# EAGLE design wts_transmitter (EAGLE 7.2.0)
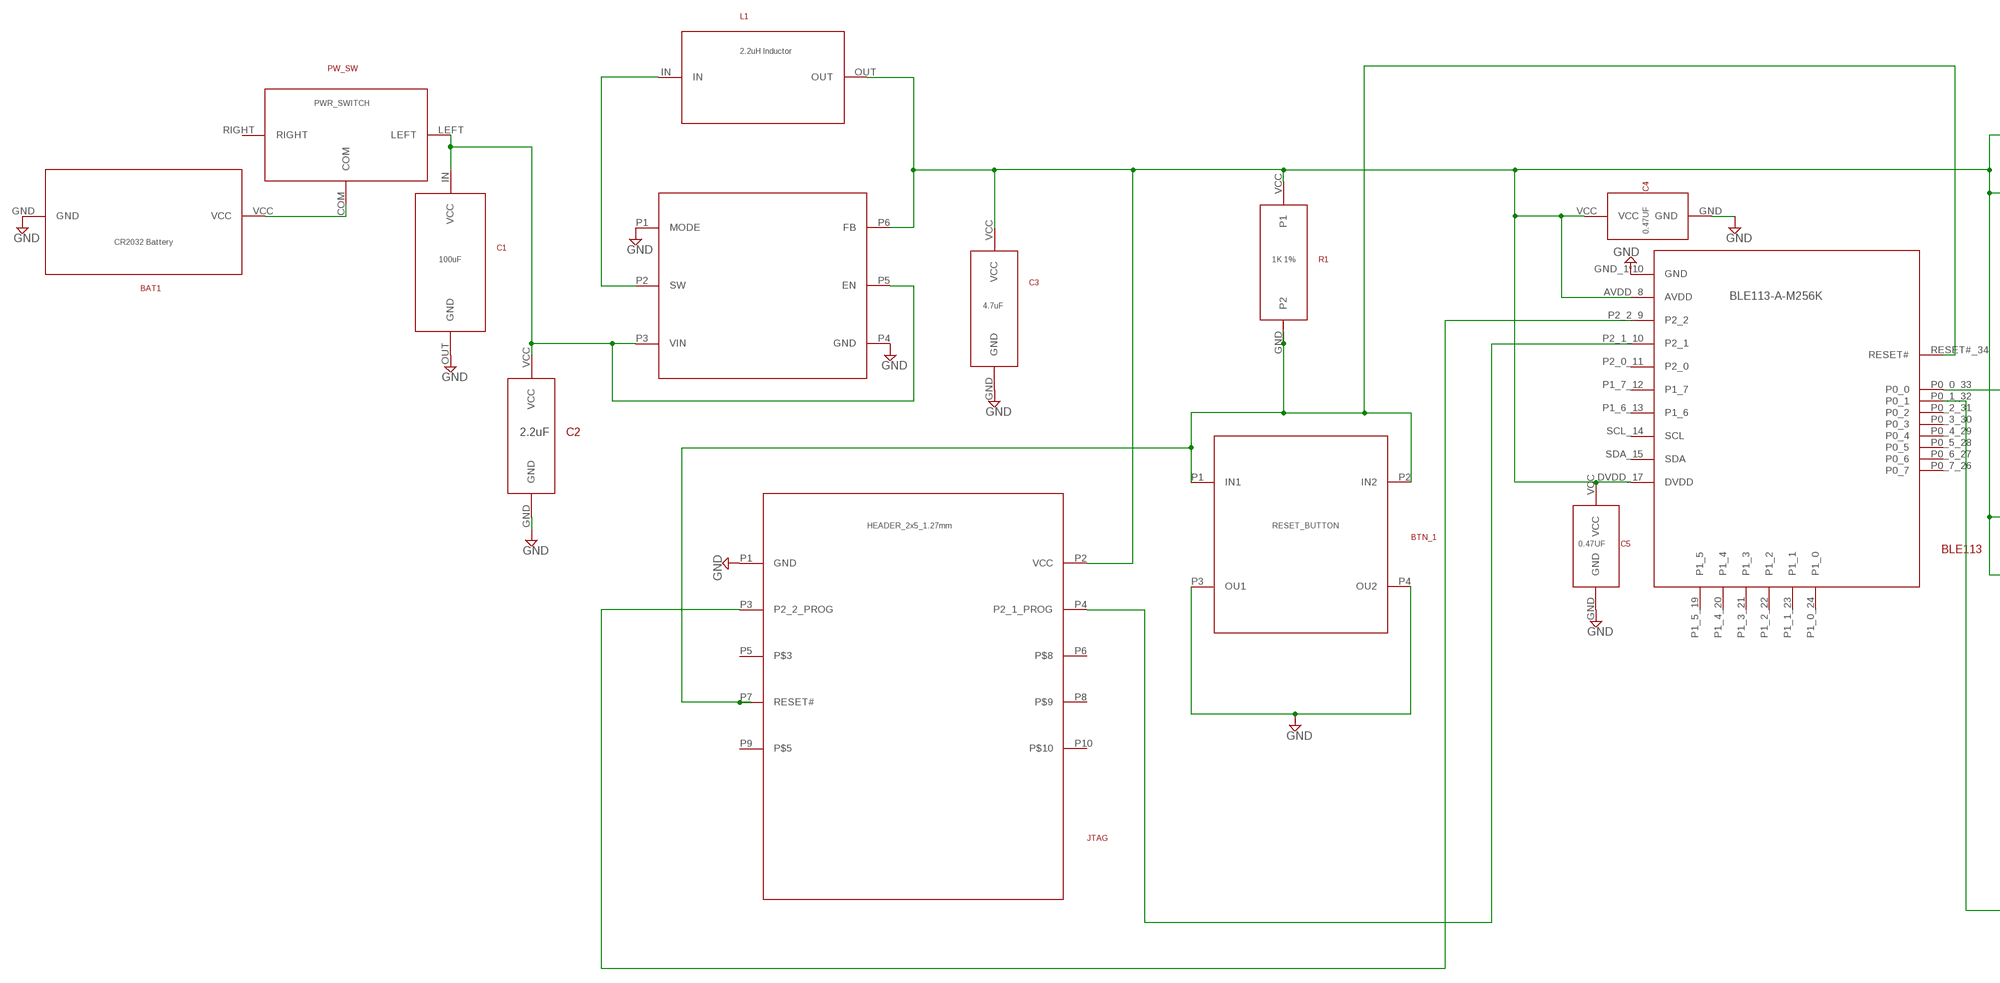
[diagram p0: schematic, sheet 1, part 1 of 2]
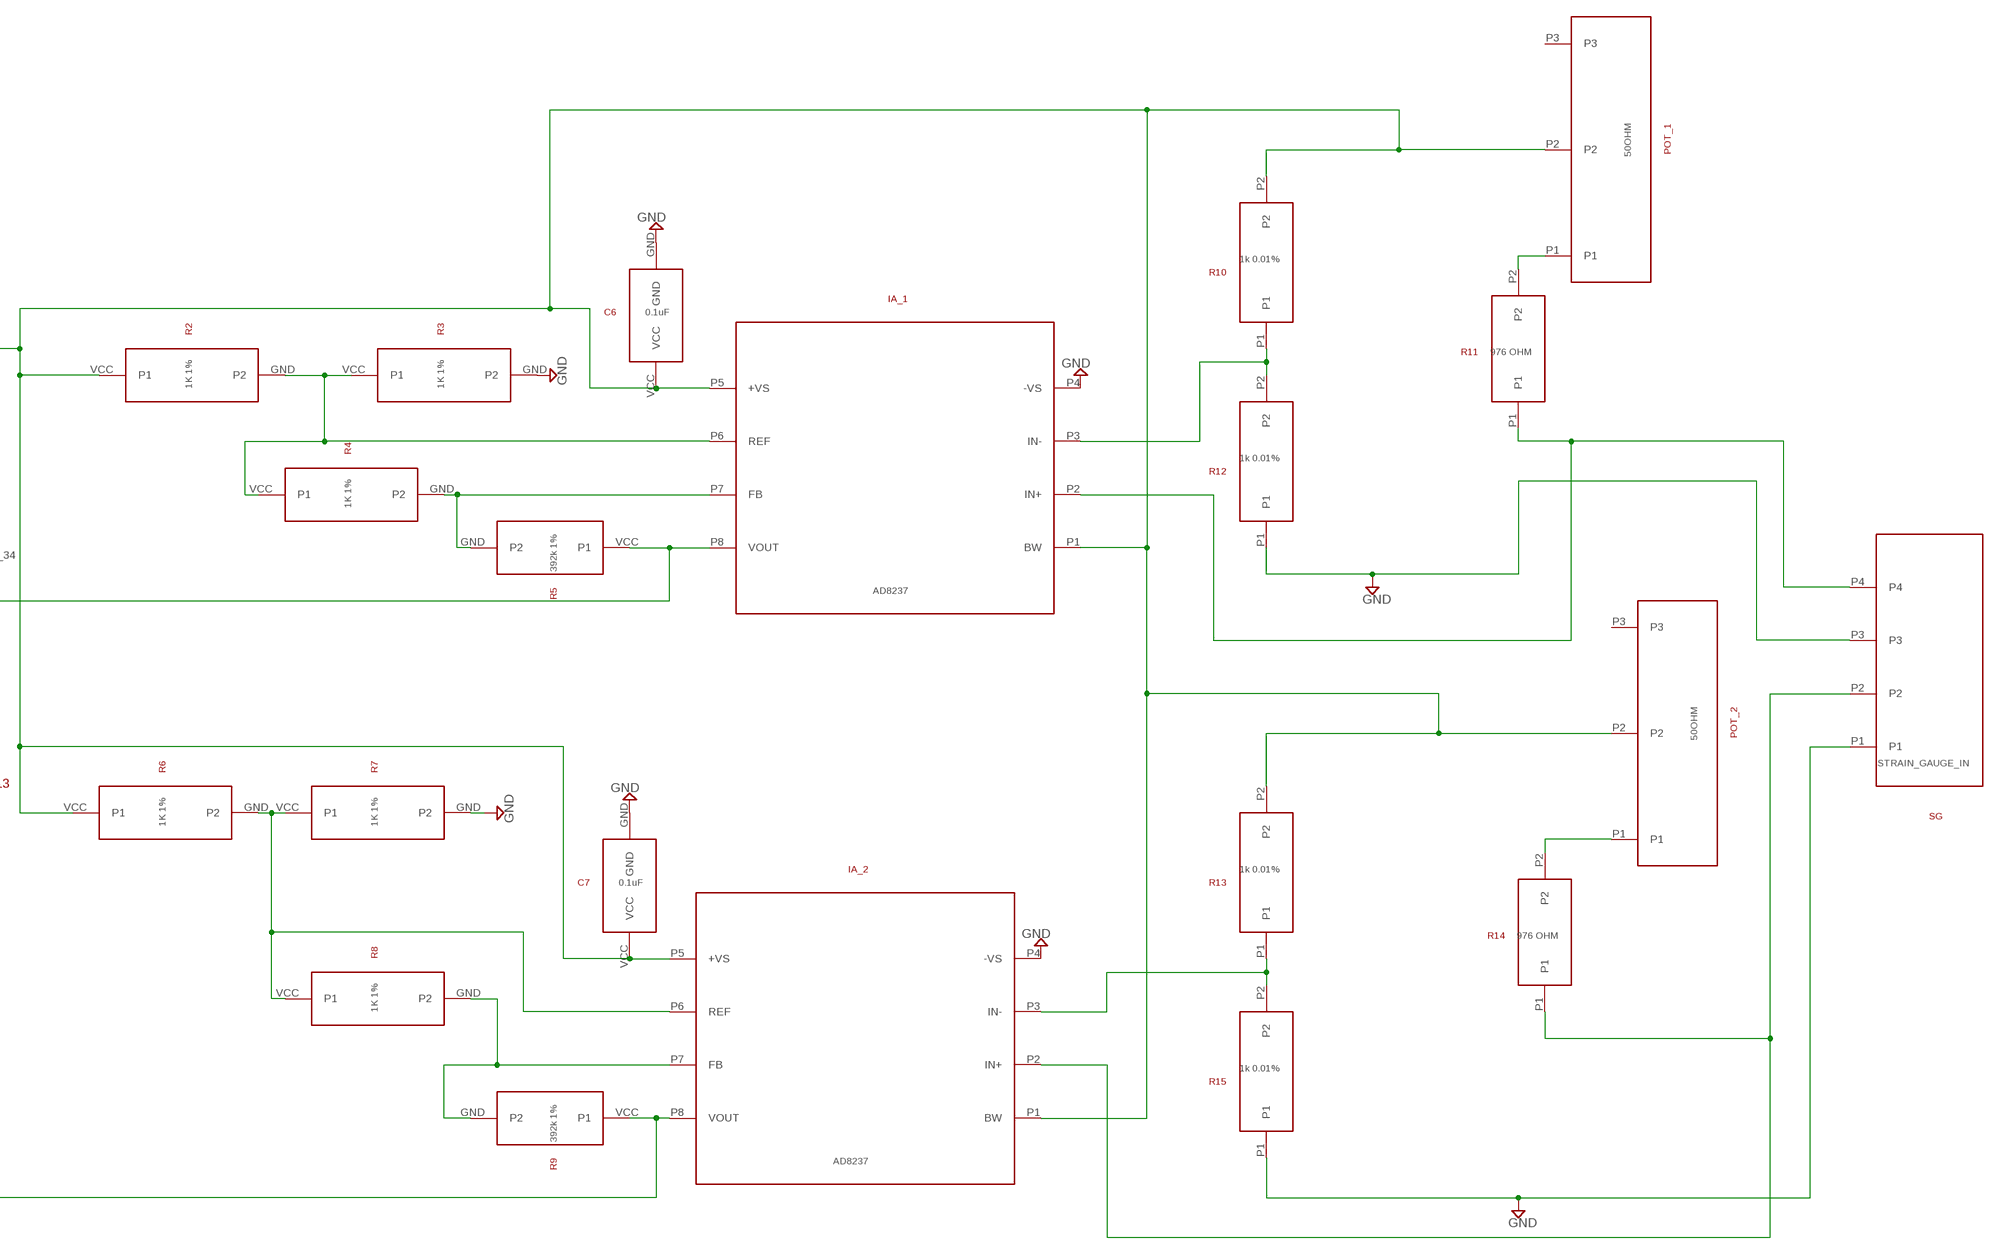
[diagram p1: schematic, sheet 1, part 2 of 2]

## Parts
BAT1  CR2032  [CR2032]
BLE113  BLE113-A-M256K  [BLE113]
BTN_1  RESET_BUTTON  [RESET_SMT]
C1  100UF_CAP  [1206]
C2  2.2UF_CAP  [0603]
C3  4.7UF_CAP  [0603]
C4  0.47UF_CAP  [0402]
C5  0.47UF_CAP  [0402]
C6  0.1UF_CAP  [0402]
C7  0.1UF_CAP  [0402]
DC_DC  TPS62234  [DRY6]
IA_1  AD8237  [MSOP8]
IA_2  AD8237  [MSOP8]
JTAG  JTAG_HEADER  [1.27MM_2X5_HEADER]
L1  2.2UH_INDUCTOR  [1206]
POT_1  50OHM_TRIMPOT  [PV36W_TRIMPOT]
POT_2  50OHM_TRIMPOT  [PV36W_TRIMPOT]
PW_SW  PWR_SWITCH  [PWR_SWITCH]
R1  1KOHM_RESISTOR_1%  [0603]
R2  1KOHM_RESISTOR_1%  [0603]
R3  1KOHM_RESISTOR_1%  [0603]
R4  1KOHM_RESISTOR_1%  [0603]
R5  392KOHM_RESISTOR_1%  [0603]
R6  1KOHM_RESISTOR_1%  [0603]
R7  1KOHM_RESISTOR_1%  [0603]
R8  1KOHM_RESISTOR_1%  [0603]
R9  392KOHM_RESISTOR_1%  [0603]
R10  1KOHM_RESISTOR_0.01%  [0805]
R11  976OHM_RESISTOR  [0805]
R12  1KOHM_RESISTOR_0.01%  [0805]
R13  1KOHM_RESISTOR_0.01%  [0805]
R14  976OHM_RESISTOR  [0805]
R15  1KOHM_RESISTOR_0.01%  [0805]
SG  4_PIN_5.08MM_TERMINAL  [5.08MM_4PIN_HEADER]

## Nets
3V: C1.IN(VCC) C2.VCC DC_DC.P3(VIN) DC_DC.P5(EN) PW_SW.LEFT
3V_BAT: BAT1.VCC PW_SW.COM
GND: BAT1.GND BLE113.GND_1(GND) BLE113.GND_2(GND) BLE113.GND_3(GND) BLE113.GND_4(GND) BLE113.GND_5(GND) BLE113.GND_6(GND) BLE113.GND_7(GND) BLE113.GND_18(GND) BLE113.GND_25(GND) BLE113.GND_36(GND) BTN_1.P3(OU1) BTN_1.P4(OU2) C1.OUT(GND) C2.GND C3.GND C4.GND C5.GND C6.GND C7.GND DC_DC.P1(MODE) DC_DC.P4(GND) IA_1.P4(-VS) IA_2.P4(-VS) JTAG.P1(GND) R3.GND(P2) R7.GND(P2) R12.P1 R15.P1 SG.P1 SG.P3
N$3: DC_DC.P2(SW) L1.IN
N$5: BLE113.P0_0_33(P0_0) IA_1.P8(VOUT) R5.VCC(P1)
N$6: BLE113.P0_1_32(P0_1) IA_2.P8(VOUT) R9.VCC(P1)
N$7: BLE113.P2_2_9(P2_2) JTAG.P3(P2_2_PROG)
N$8: IA_2.P3(IN-) R13.P1 R15.P2
N$9: IA_2.P6(REF) R6.GND(P2) R7.VCC(P1) R8.VCC(P1)
N$10: IA_2.P7(FB) R8.GND(P2) R9.GND(P2)
N$11: BLE113.P2_1_10(P2_1) JTAG.P4(P2_1_PROG)
N$12: BLE113.RESET#_34(RESET#) BTN_1.P1(IN1) BTN_1.P2(IN2) JTAG.P7(RESET#) R1.GND(P2)
N$13: IA_1.P6(REF) R2.GND(P2) R3.VCC(P1) R4.VCC(P1)
N$14: IA_1.P7(FB) R4.GND(P2) R5.GND(P2)
N$15: POT_1.P1 R11.P2
N$16: IA_1.P3(IN-) R10.P1 R12.P2
N$17: IA_1.P2(IN+) R11.P1 SG.P4
N$20: POT_2.P1 R14.P2
N$21: IA_2.P2(IN+) R14.P1 SG.P2
PWR: BLE113.AVDD_8(AVDD) BLE113.DVDD_17(DVDD) C3.VCC C4.VCC C5.VCC C6.VCC C7.VCC DC_DC.P6(FB) IA_1.P1(BW) IA_1.P5(+VS) IA_2.P1(BW) IA_2.P5(+VS) JTAG.P2(VCC) L1.OUT POT_1.P2 POT_2.P2 R1.VCC(P1) R2.VCC(P1) R6.VCC(P1) R10.P2 R13.P2
Unconnected: BLE113.P0_2_31(P0_2) BLE113.P0_3_30(P0_3) BLE113.P0_4_29(P0_4) BLE113.P0_5_28(P0_5) BLE113.P0_6_27(P0_6) BLE113.P0_7_26(P0_7) BLE113.P1_0_24(P1_0) BLE113.P1_1_23(P1_1) BLE113.P1_2_22(P1_2) BLE113.P1_3_21(P1_3) BLE113.P1_4_20(P1_4) BLE113.P1_5_19(P1_5) BLE113.P1_6_13(P1_6) BLE113.P1_7_12(P1_7) BLE113.P2_0_11(P2_0) BLE113.SCL_14(SCL) BLE113.SDA_15(SDA) JTAG.P5 JTAG.P6 JTAG.P8 JTAG.P9 JTAG.P10 POT_1.P3 POT_2.P3 PW_SW.RIGHT

## Library data of the parts
BAT1 = wts_transmitter:CR2032
BLE113 = wts_transmitter:BLE113-A-M256K
BTN_1 = wts_transmitter:RESET_BUTTON
C1 = wts_transmitter:100UF_CAP
C2 = wts_transmitter:2.2UF_CAP
C3 = wts_transmitter:4.7UF_CAP
C4 C5 = wts_transmitter:0.47UF_CAP
C6 C7 = wts_transmitter:0.1UF_CAP
DC_DC = wts_transmitter:TPS62234
IA_1 IA_2 = wts_transmitter:AD8237
JTAG = wts_transmitter:JTAG_HEADER
L1 = wts_transmitter:2.2UH_INDUCTOR
POT_1 POT_2 = wts_transmitter:50OHM_TRIMPOT
PW_SW = wts_transmitter:PWR_SWITCH
R1-R4 R6-R8 = wts_transmitter:1KOHM_RESISTOR_1%
R5 R9 = wts_transmitter:392KOHM_RESISTOR_1%
R10 R12 R13 R15 = wts_transmitter:1KOHM_RESISTOR_0.01%
R11 R14 = wts_transmitter:976OHM_RESISTOR
SG = wts_transmitter:4_PIN_5.08MM_TERMINAL

## Net classes
0 default: clearance 0.205 mm

## Board
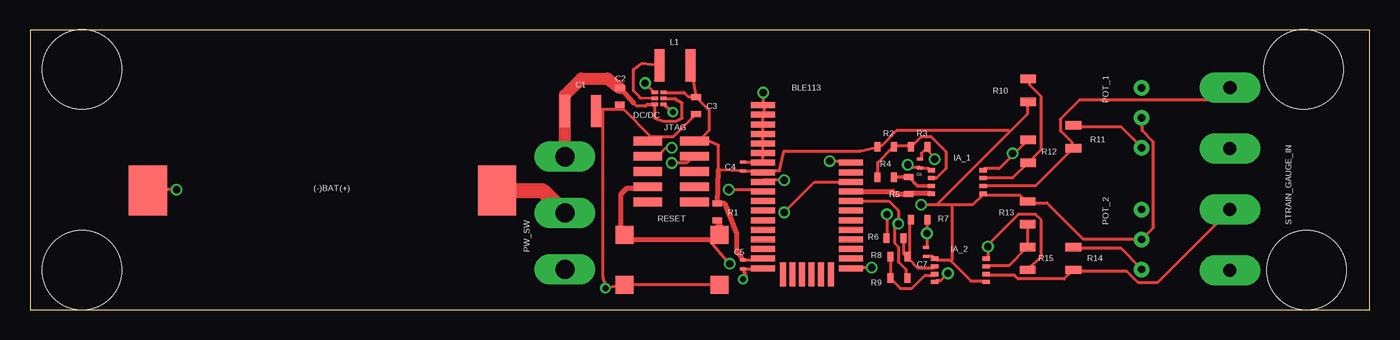
[diagram p2: board, top side]
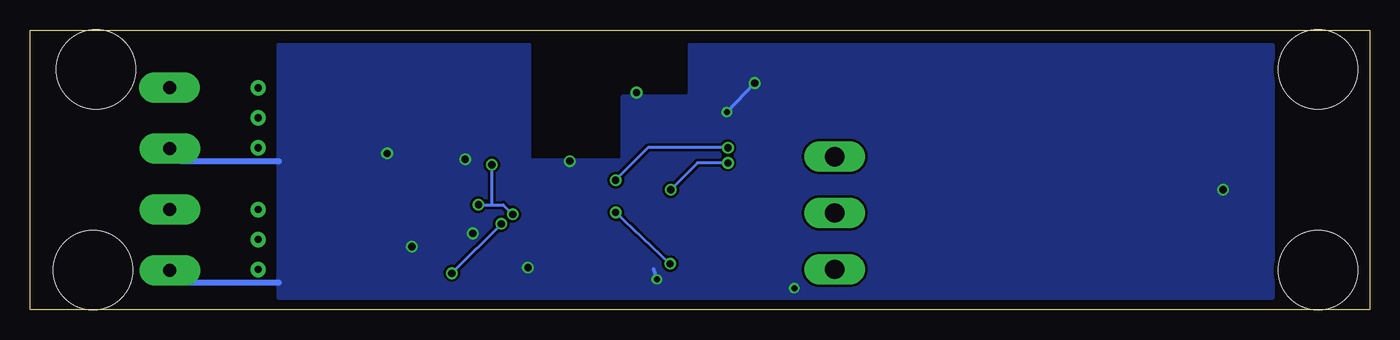
[diagram p3: board, bottom side, seen from below]

Size 111.68 x 23.36 mm. Coordinates in mm from the lower left corner, seen from the top.
Outline: 0,0 111.68,0 111.68,23.36 0,23.36 0,0
Copper layers (1*16): Top 0.0356mm / dielectric 1.5011mm / Bottom 0.0356mm
Design rules "LaenPCBOrder": minimum track width 6mil, minimum drill 13mil, track to track 6mil, track to pad 6mil, pad to pad 6mil, via to via 6mil, smd to smd 6mil, copper to edge 15mil, drill to drill 6mil, minimum pad ring 7mil, minimum via ring 7mil, stop-mask expansion 3mil, vias tented up to drill 0mil, thermal gap 10mil
Holes 6.6 mm at 4.32,20.07 4.32,3.3 106.17,20.07 106.43,3.3

### Footprints (pad centres in the part's own frame; a part is rotated, then mirrored left to right if it is on the bottom)
CR2032 = smd 3.2 x 4.2: GND 30.8,3.5; VCC 1.7,3.5
BLE113 = smd 2 x 0.5: AVDD_8 0.9,9.45; DVDD_17 0.9,2.25; GND_1 0.9,15.05; GND_2 0.9,14.25; GND_3 0.9,13.45; GND_4 0.9,12.65; GND_5 0.9,11.85; GND_6 0.9,11.05; GND_7 0.9,10.25; GND_18 0.9,1.45; GND_25 8.22,1.45; GND_36 8.22,10.25; NC_16 0.9,3.05; NC_35 8.22,9.45; P0_0_33 8.22,7.85; P0_1_32 8.22,7.05; P0_2_31 8.22,6.25; P0_3_30 8.22,5.45; P0_4_29 8.22,4.65; P0_5_28 8.22,3.85; P0_6_27 8.22,3.05; P0_7_26 8.22,2.25; P1_6_13 0.9,5.45; P1_7_12 0.9,6.25; P2_0_11 0.9,7.05; P2_1_10 0.9,7.85; P2_2_9 0.9,8.65; RESET#_34 8.22,8.65; SCL_14 0.9,4.65; SDA_15 0.9,3.85 | smd 0.5 x 2: P1_0_24 6.56,0.95; P1_1_23 5.76,0.95; P1_2_22 4.96,0.95; P1_3_21 4.16,0.95; P1_4_20 3.36,0.95; P1_5_19 2.56,0.95
RESET_SMT = smd 1.5 x 1.5: P1 0.8,5; P2 8.7,5; P3 0.8,0.8; P4 8.7,0.8
1206 = smd 0.85 x 2.7: IN 0.4,1.35; OUT 3,1.35
0603 = smd 0.8 x 0.5: GND 0.4,0.1; VCC 0.4,1.5
0402 = smd 0.5 x 0.25: GND 0.25,0.12; VCC 0.25,0.87
DRY6 = smd 0.279 x 0.52: P1 0.15,0.26; P2 0.65,0.26; P3 1.15,0.26; P4 1.15,1; P5 0.65,1; P6 0.15,1
MSOP8 = smd 0.35 x 0.6: P1 0.55,0.3; P2 1.2,0.3; P3 1.85,0.3; P4 2.5,0.3; P5 2.5,4.6; P6 1.85,4.6; P7 1.2,4.6; P8 0.55,4.6
1.27MM_2X5_HEADER = smd 2.4 x 0.74: P1 1.2,5.45; P2 5.1,5.45; P3 1.2,4.18; P4 5.1,4.18; P5 1.2,2.91; P6 5.1,2.91; P7 1.2,1.64; P8 5.1,1.64; P9 1.2,0.37; P10 5.1,0.37
PV36W_TRIMPOT = drill 0.6 pad 1.27: P1 7.3,2.5; P2 4.8,2.5; P3 2.3,2.5
PWR_SWITCH = drill 1.6 pad 2.54 long: COM 6.4,3.2; LEFT 1.7,3.2; RIGHT 11.1,3.2
0805 = smd 1.3 x 0.7: P1 0.65,2.25; P2 0.65,0.35
5.08MM_4PIN_HEADER = drill 1.1 pad 2.54 long: P1 4.11,17.78; P2 4.11,12.7; P3 4.11,7.62; P4 4.1,2.54

### Placement (x,y rotation side)
BAT1  40.64,13.46 180 top
BLE113  60.2,2.03 0 top
BTN_1  48.77,1.27 0 top
C1  44.2,15.24 0 top
C2  48.77,17.02 0 top
C3  55.12,16.26 0 top
C4  59.69,12.45 180 top
C5  59.18,3.3 0 top
C6  74.42,12.7 180 top
C7  74.93,5.33 180 top
DC_DC  51.82,18.29 270 top
IA_1  79.76,9.14 90 top
IA_2  80.01,1.78 90 top
JTAG  50.29,8.64 0 top
L1  52.07,19.05 0 top
POT_1  90.17,20.83 270 top
POT_2  90.17,10.67 270 top
PW_SW  41.4,14.48 270 top
R1  56.9,7.37 0 top
R2  72.14,13.21 90 top
R3  74.93,13.21 90 top
R4  72.14,10.67 90 top
R5  73.66,11.18 180 top
R6  72.9,5.59 90 top
R7  74.93,7.11 90 top
R8  71.63,4.83 270 top
R9  71.63,3.05 270 top
R10  82.55,17.02 0 top
R11  87.63,15.75 180 top
R12  82.55,11.94 0 top
R13  83.82,9.4 180 top
R14  87.63,5.59 180 top
R15  83.82,5.59 180 top
SG  104.14,21.08 180 top

### Tracks (layer width: path | path; a pad name or v marks a point on that pad's centre or on a via)
3V
  Top 0.254: DC_DC.P3 52.07,16 52.83,15.75 53.85,15.75 54.36,16 54.36,17.27 53.85,17.53 arc90 53.74,17.64 DC_DC.P5 | 51.31,17.02 50.55,17.02 50.29,17.27
  Top 0.305: 51.31,17.02 51.43,17.14 DC_DC.P3
  Top 0.406: C2.VCC 50.29,17.27
  Top 1.016: PW_SW.LEFT C1.IN 44.6,17.93 45.97,19.3 48.13,19.3 C2.VCC
3V_BAT
  Top 1.27: BAT1.VCC 42.72,9.96 PW_SW.COM
GND  (via drill 0.5, 0.61)
  Top 0.254: C4.GND 61.05,12.33 BLE113.GND_7 BLE113.GND_6 BLE113.GND_5 BLE113.GND_4 BLE113.GND_3 BLE113.GND_2 61.19,16.28 61.21,16.26 61.21,16.97 BLE113.GND_1 61.12,17.18 v61.12,18.13 | C5.GND 61.04,3.42 BLE113.GND_18 | BTN_1.P4 BTN_1.P3 v47.97,1.82 47.91,2.35 47.78,2.73 47.78,16.7 | 51.83,14.4 51.59,14.16 JTAG.P1 | 51.83,14.4 51.91,14.48 53.66,14.48 55.4,16.22 C3.GND | 51.83,14.4 49.45,16.78 | 49.45,16.78 49.21,17.02 C2.GND | 47.78,16.7 49.37,16.7 49.45,16.78 | 47.78,16.7 47.31,16.7 C1.OUT | IA_2.P4 79.85,4.32 v79.85,5.27 79.85,5.43 82.39,7.97 83.82,7.97 84.3,7.49 84.3,4.48 83.19,3.37 R15.P1 | 81.99,12.97 83.19,14.16 R12.P1 | 81.99,12.97 80.8,11.78 79.53,11.78 IA_1.P4 | C7.GND 74.77,5.27 v74.77,6.38 74.77,7.49 R7.GND | C6.GND 74.3,12.57 74.3,13.05 74.77,13.53 R3.GND 74.77,13.37 75.41,12.73 v75.41,12.57 | v51.28,18.92 DC_DC.P1 | v70.17,3.52 68.42,3.52 BLE113.GND_25 | v66.67,12.41 68.26,12.41 BLE113.GND_36 | v81.92,13.05 81.99,12.97 | v12.22,10.03 9.84,10.03 BAT1.GND
  Top 0.305: v59.43,2.54 59.69,2.79 C5.GND | DC_DC.P4 v53.59,16.51
  Bottom 0.254: 99.06,12.41 100.01,13.37 SG.P3 | v61.12,18.13 61.12,17.78 | 99.06,2.25 100.01,3.21 SG.P1
  Bottom 0.305: 59.69,3.42 v59.43,2.54 | v53.59,16.51 v51.28,18.92
  Bottom 0.508: 99.06,12.41 90.93,12.41 | 90.93,2.25 99.06,2.25
  pour Bottom: 8.13,1.02 90.93,1.02 90.93,22.1 70.1,22.1 70.1,12.45 62.23,12.45 62.23,17.78 56.64,17.78 56.64,22.1 8.13,22.1
N$3
  Top 0.254: L1.IN 51.05,20.57 50.29,20.07 50.29,18.29 50.8,17.78 arc90 50.94,17.67 DC_DC.P2
N$5
  Top 0.406: BLE113.P0_0_33 71.91,9.88 72.14,9.65 73.24,9.65 R5.VCC 73.28,9.69 IA_1.P8
N$6  (via drill 0.61)
  Top 0.254: v76.52,3.05 75.88,2.41 75.56,2.41 IA_2.P8 | BLE113.P0_1_32 71.6,9.08 72.39,8.29 v72.39,7.18 72.07,6.86 72.07,5.59 72.39,5.27 72.39,4 73.03,3.37 73.03,2.73 R9.VCC
  Bottom 0.254: v72.39,7.18 v76.52,3.05
N$7  (via drill 0.61)
  Top 0.254: v62.87,10.83 61.12,10.83 BLE113.P2_2_9 | v53.5,13.53 53.02,13.53 52.39,12.89 51.59,12.89 JTAG.P3
  Bottom 0.254: v62.87,10.83 60.17,13.53 v53.5,13.53
N$8
  Top 0.254: IA_2.P3 79.85,3.68 81.6,3.68 83.03,5.11 R15.P2 83.19,5.27 83.19,7.02 R13.P1
N$9
  Top 0.254: IA_2.P6 75.41,3.52 73.98,3.52 73.18,4.32 R8.VCC | R6.GND 72.87,5.91 72.87,4.64 73.03,4.48 R8.VCC | R7.VCC 73.34,7.49 73.34,4.32 R8.VCC
N$10
  Top 0.254: IA_2.P7 75.41,2.89 74.61,2.89 73.5,1.78 72.55,1.78 71.75,2.57 R9.GND 71.75,2.73 71.75,4.32 R8.GND
N$11  (via drill 0.61)
  Top 0.254: v58.26,10.03 60.96,10.03 BLE113.P2_1_10 | v53.5,12.26 54.77,12.26 55.24,12.73 JTAG.P4
  Bottom 0.254: v58.26,10.03 56.04,12.26 v53.5,12.26
N$12  (via drill 0.61)
  Top 0.254: v62.87,8.13 65.41,10.67 68.26,10.67 BLE113.RESET#_34 | v58.33,3.84 56.67,5.75 56.67,5.84
  Top 0.406: BTN_1.P2 R1.GND 57.8,6.24 57.4,5.84 56.67,5.84 50,5.84 BTN_1.P1 49.28,6.56 49.28,9.65 49.78,10.16 51.38,10.16 JTAG.P7
  Bottom 0.254: v58.33,3.84 v62.87,8.13
N$13
  Top 0.254: R4.VCC 70.64,11.14 70.64,12.26 71.91,13.53 R2.GND 72.07,13.68 73.34,13.68 R3.VCC 73.5,13.68 74.3,14.48 75.09,14.48 76.36,13.21 76.36,11.78 75.56,10.99 75.25,10.99 IA_1.P6
N$14
  Top 0.305: IA_1.P7 73.99,10.34 R5.GND R4.GND
N$15
  Top 0.254: R11.P2 87,15.27 90.96,15.27 92.55,13.68 POT_1.P1
N$16
  Top 0.254: IA_1.P3 79.53,10.99 81.92,10.99 83.19,12.26 R12.P2 83.34,12.41 84.3,13.37 84.3,17.81 83.34,18.76 83.34,19.24 R10.P1
N$17
  Top 0.254: IA_1.P2 79.53,10.35 83.82,10.35 86.84,13.37 R11.P1 86.84,13.53 86.84,14 85.88,14.95 85.88,15.91 87.47,17.49 99.06,17.49 100.01,18.45 SG.P4
N$20
  Top 0.254: R14.P2 87,5.11 90.96,5.11 92.55,3.52 POT_2.P1
N$21
  Top 0.254: IA_2.P2 79.85,2.89 82.07,2.89 82.39,2.57 86.2,2.57 86.84,3.21 R14.P1 87,3.21 91.44,3.21 92.39,2.25 93.98,2.25 100.01,8.29 SG.P2
PWR  (via drill 0.61)
  Top 0.254: L1.OUT C3.VCC | C3.VCC 56.64,16.63 56.64,14.99 55.74,14.09 JTAG.P2 56.27,14.22 57.4,13.72 57.4,11.68 C4.VCC 61,11.58 BLE113.AVDD_8 | BLE113.AVDD_8 61.01,11.48 60.96,11.43 | C5.VCC 60.99,4.17 BLE113.DVDD_17 | BLE113.AVDD_8 61.12,11.62 62.48,11.62 62.87,13.27 69.22,13.27 R2.VCC 70.64,13.68 70.96,13.68 72.23,14.95 81.6,14.95 81.68,14.88 | C7.VCC 74.77,4.48 75.25,4.48 75.41,4.32 IA_2.P5 75.56,4.16 76.68,4.16 76.76,4.08 | 76.76,4.08 78.42,2.41 79.69,2.41 IA_2.P1 | IA_1.P5 75.09,11.62 74.93,11.78 74.3,11.78 C6.VCC 74.14,11.94 73.34,11.94 v73.18,12.1 | v71.44,7.97 71.44,6.06 R6.VCC | 76.83,8.76 78.58,8.76 79.38,9.56 IA_1.P1 79.53,9.56 82.55,9.56 83.03,9.08 R13.P2 83.19,8.92 84.77,8.92 87.79,5.91 92.55,5.91 POT_2.P2 92.71,5.91 93.66,6.86 93.66,14 92.71,14.95 92.71,15.91 POT_1.P2 | 76.83,8.76 75.56,8.76 | 75.56,8.76 v74.3,8.76 | 75.56,8.76 81.68,14.88 | 81.68,14.88 83.19,16.38 83.19,17.34 R10.P2 | 76.83,8.76 76.83,4.16 76.76,4.08 | DC_DC.P6 54.51,18.14 arc-90 54.61,18.03 54.86,17.78 55.49,17.78 C3.VCC
  Top 0.406: 57.4,11.68 R1.VCC 57.94,8.87 58.93,6.35 58.93,4.93 C5.VCC
  Bottom 0.254: v71.44,7.97 72.23,8.76 73.18,8.76 | v74.3,8.76 73.18,8.76 | 73.18,8.76 v73.18,12.1

### Text on the board
tPlace: L1 | C1 | C2 | BLE113 | R10 | C3 | POT_1 | DC/DC | JTAG | R2 | R3 | R11 | R12 | C4 | R4 | IA_1 | C6 | (-)BAT(+) | R5 | R1 | R13 | RESET | R7 | POT_2 | STRAIN_GAUGE_IN | R6 | PW_SW | C5 | IA_2 | R8 | C7 | R15 | R14 | R9